# EasyEDA schematic EasyEdaScheme.json
TITLE: WeatherStation; REV: 1.0; Date: 2022-03-23; Sheet: 1/1; Drawn By: Nikpesu; Company: -
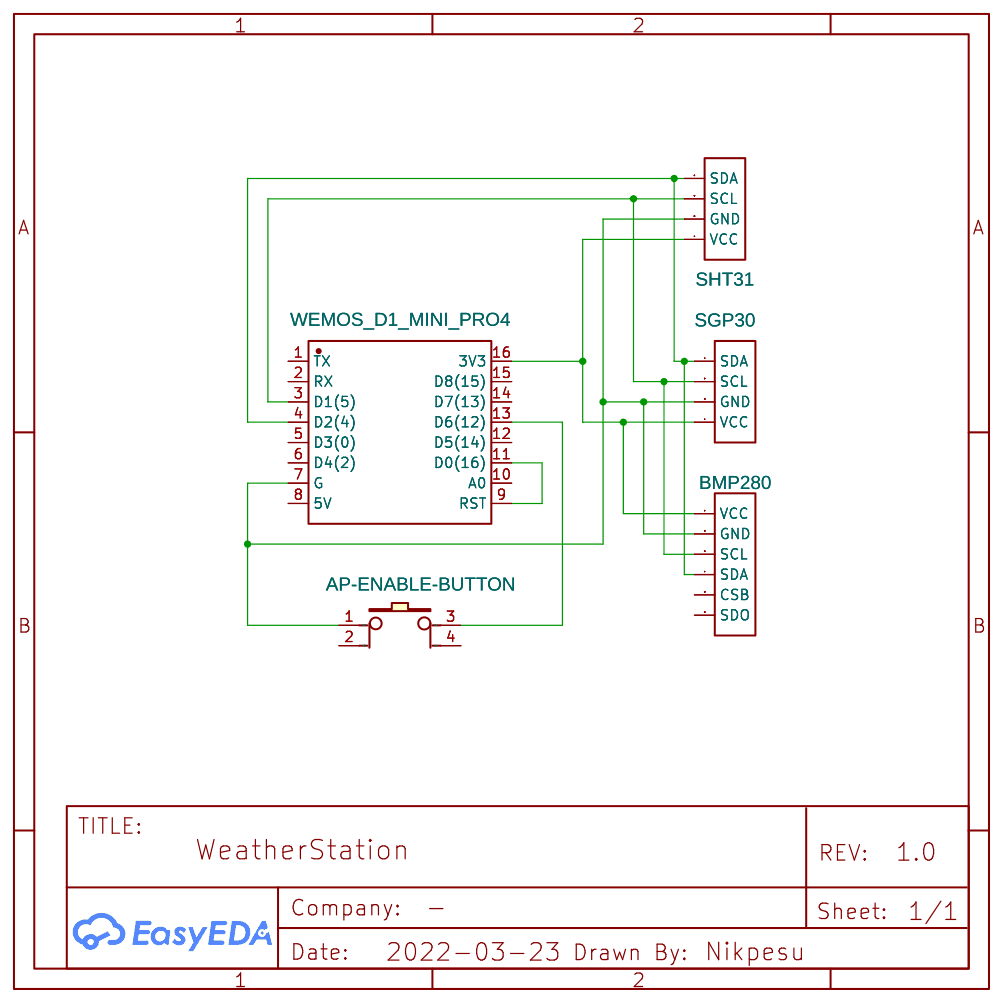
[diagram p0: schematic sheet]

## Parts
AP-ENABLE-BUTTON  button6*6*8.5  [KEY-TH_4P-L6.0-W6.0-P4.50]
BMP280  HDR-F-2.54_1x6  [HDR-F-2.54_1X6]
SGP30  HDR-F-2.54_1x4  [HDR-F-2.54_1X4]
SHT31  HDR-F-2.54_1x4  [HDR-F-2.54_1X4]
U1  WEMOS_D1_MINI_PRO4  [DIP-16_WEMOS_D1_MINI_PRO4]

## Library data of the parts
AP-ENABLE-BUTTON = button6*6*8.5: Supplier Part: C59980; Supplier: LCSC; Manufacturer: ReliaPro
BMP280 = HDR-F-2.54_1x6: Supplier Part: C40877; Supplier: LCSC; Contributor: LCEDA_Lib
SGP30 SHT31 = HDR-F-2.54_1x4: Supplier Part: C225501; Supplier: LCSC; Contributor: LCEDA_Lib
U1 = WEMOS_D1_MINI_PRO4: Supplier: LCSC; Supplier Part: C2837266; Manufacturer: null; Manufacturer Part: Wemos_D1_mini_Pro4; Contributor: LCSC; JLCPCB Part Class: Extended Part

## Nets
Net-(AP-ENABLE-BUTTON-1): AP-ENABLE-BUTTON.1 BMP280.2(GND) SGP30.3(GND) SHT31.3(GND) U1.7(G)
Net-(AP-ENABLE-BUTTON-3): AP-ENABLE-BUTTON.3 U1.13(D6(12))
Net-(BMP280-1): BMP280.1(VCC) SGP30.4(VCC) SHT31.4(VCC) U1.16(3V3)
Net-(BMP280-3): BMP280.3(SCL) SGP30.2(SCL) SHT31.2(SCL) U1.3(D1(5))
Net-(BMP280-4): BMP280.4(SDA) SGP30.1(SDA) SHT31.1(SDA) U1.4(D2(4))
Net-(U1-9): U1.9(RST) U1.11(D0(16))

Not connected (* = marked no-connect by the designer): AP-ENABLE-BUTTON 2 4; BMP280 5(CSB) 6(SDO); U1 1(TX) 2(RX) 5(D3(0)) 6(D4(2)) 8(5V) 10(A0) 12(D5(14)) 14(D7(13)) 15(D8(15))
